# Altium schematic sheet HLW8012-Demo.SchDoc
size A4
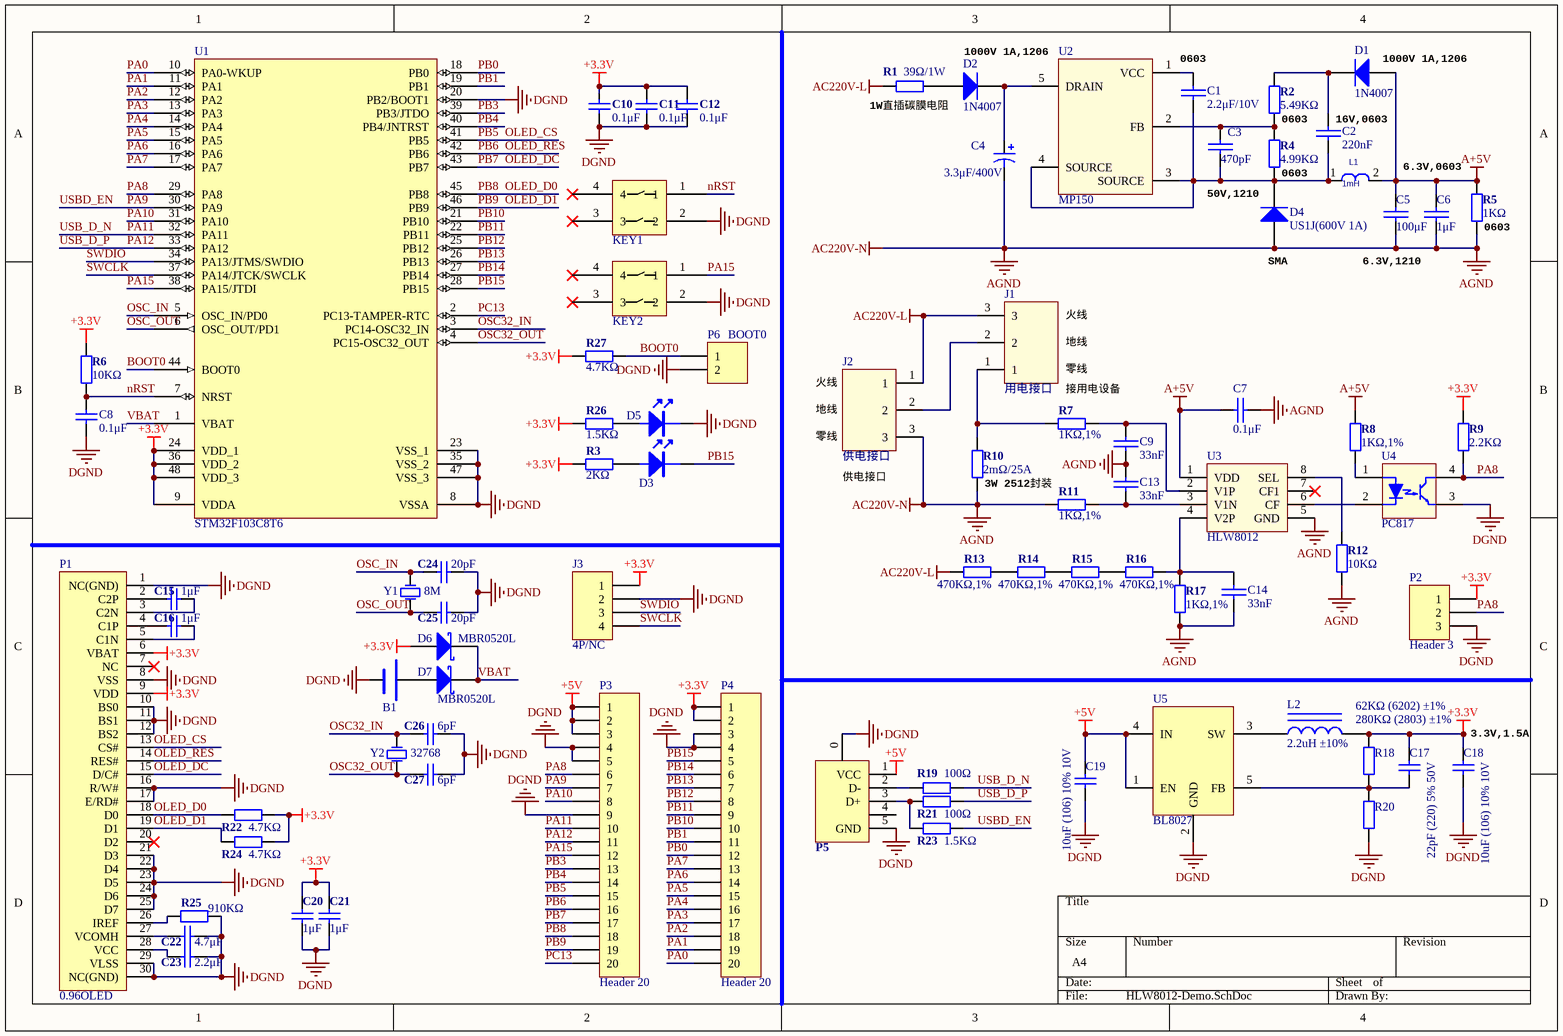
[diagram p0: HLW8012-Demo.SchDoc]

## Parts
B1  BAT  [BATTERY SOCKET]  (value not drawn)
C1  2.2μF/10V  [LC-0603_C]
C2  220nF  [LC-0603_C]
C3  470pF  [LC-0603_C]
C4  3.3μF/400V  [CAP-ELECT-TH-6.3X7]
C5  100μF  [LC-1210_C]
C6  1μF  [LC-0603_C]
C7  0.1μF  [LC-0603_C]
C8  0.1μF  [LC-0603_C]
C9  33nF  [LC-0805_C]
C10  0.1μF  [LC-0603_C]
C11  0.1μF  [LC-0603_C]
C12  0.1μF  [LC-0603_C]
C13  33nF  [LC-0805_C]
C14  33nF  [LC-0805_C]
C15  1μF  [LC-0603_C]
C16  1μF  [LC-0603_C]
C17  22pF (220) 5% 50V  [LC-0603_C]
C18  10uF (106) 10% 10V  [LC-0603_C]
C19  10uF (106) 10% 10V  [LC-0603_C]
C20  1μF  [LC-0603_C]
C21  1μF  [LC-0603_C]
C22  4.7μF  [LC-0603_C]
C23  2.2μF  [LC-0603_C]
C24  20pF  [LC-0603_C]
C25  20pF  [LC-0603_C]
C26  6pF  [LC-0603_C]
C27  6pF  [LC-0603_C]
D1  1N4007  [LC-SMA(DO-214AC)_S1]
D2  1N4007  [LC-SMA(DO-214AC)_S1]
D3  POWER  [LC-0603_LED_S1]  (value not drawn)
D4  US1J(600V 1A)  [LC-SMA(DO-214AC)_S1]
D5  POWER  [LC-0603_LED_S1]  (value not drawn)
D6  MBR0520L  [LC-SOD-123]
D7  MBR0520L  [LC-SOD-123]
J1  用电接口  [3.81-3P]
J2  供电接口  [3.81-3P]
J3  4P/NC  [HDR1X4]
KEY1  KEY  [KEY_4X4 - 6*6]  (value not drawn)
KEY2  KEY  [KEY_4X4 - 6*6]  (value not drawn)
L1  1mH  [L-10X14]
L2  2.2uH ±10%  [LC-0805_L]
P1  0.96OLED  [OLED_0.96]
P2  Header 3  [HDR1X3]
P3  Header 20  [HDR1X20]
P4  Header 20  [HDR1X20]
P5  Micro USB,母头  [MicroUSB2]  (value not drawn)
P6  BOOT0  [HDR1X2]
R1  39Ω/1W  [R-1W-THT]
R2  5.49KΩ  [LC-0603_R]
R3  2KΩ  [LC-0603_R]
R4  4.99KΩ  [LC-0603_R]
R5  1KΩ  [LC-0805_R]
R6  10KΩ  [LC-0603_R]
R7  1KΩ,1%  [LC-0805_R]
R8  1KΩ,1%  [LC-0805_R]
R9  2.2KΩ  [LC-0603_R]
R10  2mΩ/25A  [R2512]
R11  1KΩ,1%  [LC-0805_R]
R12  10KΩ  [LC-0603_R]
R13  470KΩ,1%  [LC-0805_R]
R14  470KΩ,1%  [LC-0805_R]
R15  470KΩ,1%  [LC-0805_R]
R16  470KΩ,1%  [LC-0805_R]
R17  1KΩ,1%  [LC-0805_R]
R18  280KΩ (2803) ±1%  [LC-0603_R]
R19  100Ω  [LC-0603_R]
R20  62KΩ (6202) ±1%  [LC-0603_R]
R21  100Ω  [LC-0603_R]
R22  4.7KΩ  [LC-0603_R]
R23  1.5KΩ  [LC-0603_R]
R24  4.7KΩ  [LC-0603_R]
R25  910KΩ  [LC-0603_R]
R26  1.5KΩ  [LC-0603_R]
R27  4.7KΩ  [LC-0603_R]
U1  STM32F103C8T6  [LC-LQFP-48_7x7x05P]
U2  MP150  [LC-SOT-23-5]
U3  HLW8012  [LC-SOP-8_150mil]
U4  PC817  [LC-SMD-4]
U5  BL8027  [LC-SOT-23-5]
Y1  8M  [LC-HC-49SMD]
Y2  32768  [MC-306]

## Nets
+3.3V: C10.2 C11.2 C12.2 C17.2 C18.2 C20.2 C21.2 D6.1(A) J3.1 L2.2 P1.6(VBAT) P1.9(VDD) P2.1 P4.1 P4.2 R3.2 R6.2 R9.2 R18.1 R22.1 R24.1 R26.2 R27.2 U1.9(VDDA) U1.24(VDD_1) U1.36(VDD_2) U1.48(VDD_3)
+5V: C19.2 P3.1 P3.2 P3.3 P5.1(VCC) U5.1(EN) U5.4(IN)
A+5V: C5.2 C6.2 C7.1 D1.1(A) L1.2 R5.2 R8.2 U3.1(VDD)
AC220V-L: J1.3 J2.1 R1.1 R13.2
AC220V-N: C4.2 C5.1 C6.1 C7.2 C9.2 C13.1 C14.2 D4.1(A) J2.3 R5.1 R10.2 R11.2 R12.2 R17.2 U3.5(GND)  [also labelled AGND]
DGND: B1.2 C8.1 C10.1 C11.1 C12.1 C18.1 C19.1 C20.1 C21.1 C22.1 C23.1 C24.2 C25.2 C26.2 C27.2 D5.K J3.2 KEY1.2 KEY2.2 P1.1(NC(GND)) P1.8(VSS) P1.10(BS0) P1.11(BS1) P1.12(BS2) P1.16(R/W#) P1.17(E/RD#) P1.21(D3) P1.22(D4) P1.23(D5) P1.24(D6) P1.25(D7) P1.29(VLSS) P1.30(NC(GND)) P2.3 P3.4 P3.5 P3.9 P4.3 P4.4 P5.0(GND) P5.5(GND) P6.2 R20.1 R25.1 U1.8(VSSA) U1.20(PB2/BOOT1) U1.23(VSS_1) U1.35(VSS_2) U1.47(VSS_3) U4.3(A2) U5.2(GND)
BOOT0: P6.1 R27.1 U1.44(BOOT0)
nRST: C8.2 KEY1.1 R6.1 U1.7(NRST)
OLED_CS: P1.13(CS#) P3.15 U1.41(PB5)  [also labelled PB5]
OLED_D0: P1.18(D0) P3.18 R22.2 U1.45(PB8)  [also labelled PB8]
OLED_D1: P1.19(D1) P3.19 R24.2 U1.46(PB9)  [also labelled PB9]
OLED_DC: P1.15(D/C#) P3.17 U1.43(PB7)  [also labelled PB7]
OLED_RES: P1.14(RES#) P3.16 U1.42(PB6)  [also labelled PB6]
OSC32_IN: C26.1 U1.3(PC14-OSC32_IN) Y2.1
OSC32_OUT: C27.1 U1.4(PC15-OSC32_OUT) Y2.4
OSC_IN: C24.1 U1.5(OSC_IN/PD0) Y1.1
OSC_OUT: C25.1 U1.6(OSC_OUT/PD1) Y1.2
PA0: P4.20 U1.10(PA0-WKUP)
PA1: P4.19 U1.11(PA1)
PA2: P4.18 U1.12(PA2)
PA3: P4.17 U1.13(PA3)
PA4: P4.16 U1.14(PA4)
PA5: P4.15 U1.15(PA5)
PA6: P4.14 U1.16(PA6)
PA7: P4.13 U1.17(PA7)
PA8: P2.2 P3.6 R9.1 U1.29(PA8) U4.4(K2)
PA9: P3.7 R23.1 U1.30(PA9)  [also labelled USBD_EN]
PA10: P3.8 U1.31(PA10)
PA11: P3.10 R19.1 U1.32(PA11)  [also labelled USB_D_N]
PA12: P3.11 R21.1 U1.33(PA12)  [also labelled USB_D_P]
PA15: KEY2.1 P3.12 U1.38(PA15/JTDI)
PB0: P4.12 U1.18(PB0)
PB1: P4.11 U1.19(PB1)
PB3: P3.13 U1.39(PB3/JTDO)
PB4: P3.14 U1.40(PB4/JNTRST)
PB10: P4.10 U1.21(PB10)
PB11: P4.9 U1.22(PB11)
PB12: P4.8 U1.25(PB12)
PB13: P4.7 U1.26(PB13)
PB14: P4.6 U1.27(PB14)
PB15: D3.K P4.5 U1.28(PB15)
PC13: P3.20 U1.2(PC13-TAMPER-RTC)
SWCLK: J3.4 U1.37(PA14/JTCK/SWCLK)
SWDIO: J3.3 U1.34(PA13/JTMS/SWDIO)
VBAT: D6.2(K) D7.2(K) U1.1(VBAT)
NetB1_1: B1.1 D7.1(A)
NetC1_1: C1.1 C2.1 C3.1 D4.2(K) L1.1 R4.1 U2.3(SOURCE) U2.4(SOURCE)
NetC1_2: C1.2 U2.1(VCC)
NetC2_2: C2.2 D1.2(K) R2.2
NetC3_2: C3.2 R2.1 R4.2 U2.2(FB)
NetC4_1: C4.1 D2.2(K) U2.5(DRAIN)
NetC9_1: C9.1 R7.1 U3.2(V1P)
NetC13_2: C13.2 R11.1 U3.3(V1N)
NetC14_1: C14.1 R16.1 R17.1 U3.4(V2P)
NetC15_1: C15.1 P1.3(C2N)
NetC15_2: C15.2 P1.2(C2P)
NetC16_1: C16.1 P1.5(C1N)
NetC16_2: C16.2 P1.4(C1P)
NetC17_1: C17.1 R18.2 R20.2 U5.5(FB)
NetC22_2: C22.2 P1.27(VCOMH)
NetC23_2: C23.2 P1.28(VCC)
NetD2_1: D2.1(A) R1.2
NetD3_A: D3.A R3.1
NetD5_A: D5.A R26.1
NetJ1_1: J1.1 R7.2 R10.1
NetJ1_2: J1.2 J2.2
NetL2_1: L2.1 U5.3(SW)
NetP1_26: P1.26(IREF) R25.2
NetP5_2: P5.2(D-) R19.2
NetP5_3: P5.3(D+) R21.2 R23.2
NetR8_1: R8.1 U4.1(A1)
NetR12_1: R12.1 U3.8(SEL)
NetR13_1: R13.1 R14.2
NetR14_1: R14.1 R15.2
NetR15_1: R15.1 R16.2
NetU3_6: U3.6(CF) U4.2(K1)

Not connected (* = marked no-connect by the designer): KEY1 3* 4*; KEY2 3* 4*; P1 7(NC)* 20(D2)*; P5 4; U3 7(CF1)*

## Notes on the sheet
- (near R1) 1W直插碳膜电阻
- 1000V 1A,1206
- 0603
- (near D1) 1000V 1A,1206
- (near R2) 0603
- (near R4) 0603
- (near C2) 16V,0603
- 6.3V,0603
- 50V,1210
- (near R5) 0603
- (near D4) SMA
- 6.3V,1210
- 火线
- 地线
- 零线
- (near R7) 接用电设备
- (near J2) 供电接口
- (near R10) 3W 2512封装
- (near C18) 3.3V,1.5A

## Library data of the parts
B1 = BAT: 电池; Value: 红色; 物料: *; 名称: *; 规格: *; 封装: *; 设备: *; RoHS: *; 贴?: *; 器件: *; ComponentLink1Description: *; ComponentLink1URL: *
C1-C3 C5-C7 C9 C13 C14 = CAP: 贴片电容; Value: 100nF (104) ±10% 50V
C4 = Cap Pol1: 直插电解电容; Value: 2.2μF/400V; Published: 8-Jun-2000; LatestRevisionDate: 17-Jul-2002; LatestRevisionNote: Re-released for DXP Platform.; PackageReference: RB7.6-15; Publisher: Altium Limited
C8 C10-C12 C22-C27 = Cap: 贴片电容; 名称: 电容; 封装: 0805; 型号: 1μF
C15 C16 C20 C21 = Cap: 贴片电容; 名称: 电容; 封装: 0805; 型号: 1μF
C17 = 0402 22pF (220) 5% 50V: 贴片电容; ComponentLink1Description: 供应商链接; ComponentLink1URL: http://www.szlcsc.com/product/details_1907.html; Package: 0402; Supplier: LC; SuppliersPartNumber: C1555
C18 C19 = 0603 10uF (106) 10% 10V: 贴片电容; ComponentLink1Description: 供应商链接; ComponentLink1URL: http://www.szlcsc.com/product/details_20411.html; Package: 0603; Supplier: LC; SuppliersPartNumber: C19702
D1 D2 D4 = Diode 1N5408: 贴片二极管; Published: 8-Jun-2000; LatestRevisionDate: 17-Jul-2002; LatestRevisionNote: Re-released for DXP Platform.; DatasheetDocument: Aug-1984; PackageReference: DO-201AD; Publisher: Altium Limited; ComponentLink1Description: Manufacturer Link; ComponentLink1URL: http://www.irf.com/
D3 = L: 发光二极管; Value: 红色; 物料: *; 名称: *; 规格: *; 封装: *; 设备: *; RoHS: *; 贴?: *; 器件: *; ComponentLink1Description: *; ComponentLink1URL: *
D5 = LED1: 发光二极管; Value: 红色; 物料: *; 名称: *; 规格: *; 封装: *; 设备: *; RoHS: *; 贴?: *; 器件: *; ComponentLink1Description: *; ComponentLink1URL: *
D6 D7 = Diode 18TQ045: 贴片肖特基二极管; Note: Terminal 2 is the TAB and is electrically connected to the cathode; Published: 8-Jun-2000; LatestRevisionDate: 17-Jul-2002; LatestRevisionNote: Re-released for DXP Platform.; DatasheetVersion: Dec-1997; PackageVersion: Feb-1998; PackageReference: TO-220AC; Publisher: Altium Limited; PackageDescription: TO, Thru-Hole, Vertical, Heatsink Mounted; 3 In-Line Leads (1 Absent); Pitch 2.54 mm; ComponentLink1Description: Manufacturer Link; ComponentLink1URL: http://www.irf.com/; ComponentLink2Description: Datasheet; ComponentLink2URL: http://www.irf.com/product-info/datasheets/data/18tq.pdf
J1 J2 = Port-3P: 直插接线端子
J3 = Header 4: 接口; LatestRevisionDate: 17-Jul-2002; LatestRevisionNote: Re-released for DXP Platform.; Publisher: Altium Limited
KEY1 KEY2 = KEY: 贴片轻触开关; Value: 轻触开关/6x6x5
L1 = IND_8: 直插绕线电感; CISPartType: Inductor\Ferrite; OriginalSymbolOrigin: (0,0); ATHEROS KEY: 078-100LM-000; AtherosDescription: IND,SMT,SHIELDING CHOKE,10uH,7.3x7.3
L2 = 0805 2.2uH 10%: 贴片电感; ComponentLink1Description: 供应商链接; ComponentLink1URL: http://www.szlcsc.com/product/details_1395.html; Package: 0805; Supplier: LC; SuppliersPartNumber: C1043
P1 = 0.96OLED: 接口; LatestRevisionDate: 17-Jul-2002; LatestRevisionNote: Re-released for DXP Platform.; Publisher: Altium Limited
P2 = Header 3: Header, 3-Pin; LatestRevisionDate: 17-Jul-2002; LatestRevisionNote: Re-released for DXP Platform.; Publisher: Altium Limited
P3 P4 = Header 20: Header, 20-Pin; LatestRevisionDate: 17-Jul-2002; LatestRevisionNote: Re-released for DXP Platform.; Publisher: Altium Limited
P5 = microUSB: 接口
P6 = Header 2: Header, 2-Pin; LatestRevisionDate: 17-Jul-2002; LatestRevisionNote: Re-released for DXP Platform.; Publisher: Altium Limited
R1-R4 R6 R9 R10 R12-R16 R19 R21-R27 = 电阻: 贴片电阻; 型号: 1KΩ; 名称: 电阻
R5 R7 R8 R11 R17 = 电阻: 贴片电阻; 型号: 1KΩ; 名称: 电阻
R18 R20 = 0805 62KΩ (6202) 1%: 贴片电阻; ComponentLink1Description: 供应商链接; Package: 0402; Supplier: LC; SuppliersPartNumber: C17783
  R20: ComponentLink1URL: http://www.szlcsc.com/product/details_18471.html
U1 = STM32F103CBT6: IC; 封装: LQFP48; 厂商: ST; Published: 30-May-2008; DatasheetVersion: rev6, Mar-2008; PackageVersion: Mar-2008; PackageReference: LQFP48; Publisher: Altium Limited; PackageDescription: 48-Pin Low-Profile Quad Flat Pack, 7 x 7 mm Body, 0.5 mm Pitch (LQFP48); ComponentLink1Description: Manufacturer Link; ComponentLink1URL: www.st.com/stm32; ComponentLink2Description: Datasheet; ComponentLink2URL: http://www.st.com/stonline/products/literature/ds/13587.pdf; 名称: IC; 型号: STM32F103CBT6
U2 = MP150: IC
U3 = HLW8012: IC
U4 = PS2501L-1-F3-A: IC
U5 = DC-DC: IC
Y1 Y2 = XTAL_1: 晶振（直插）; Value: 25MHz ±20ppm 20pF; Published: 8-Jun-2000; LatestRevisionDate: 17-Jul-2002; LatestRevisionNote: Re-released for DXP Platform.; PackageReference: R38; Publisher: Altium Limited